# Altium schematic sheet Napajanje.SchDoc
size A4
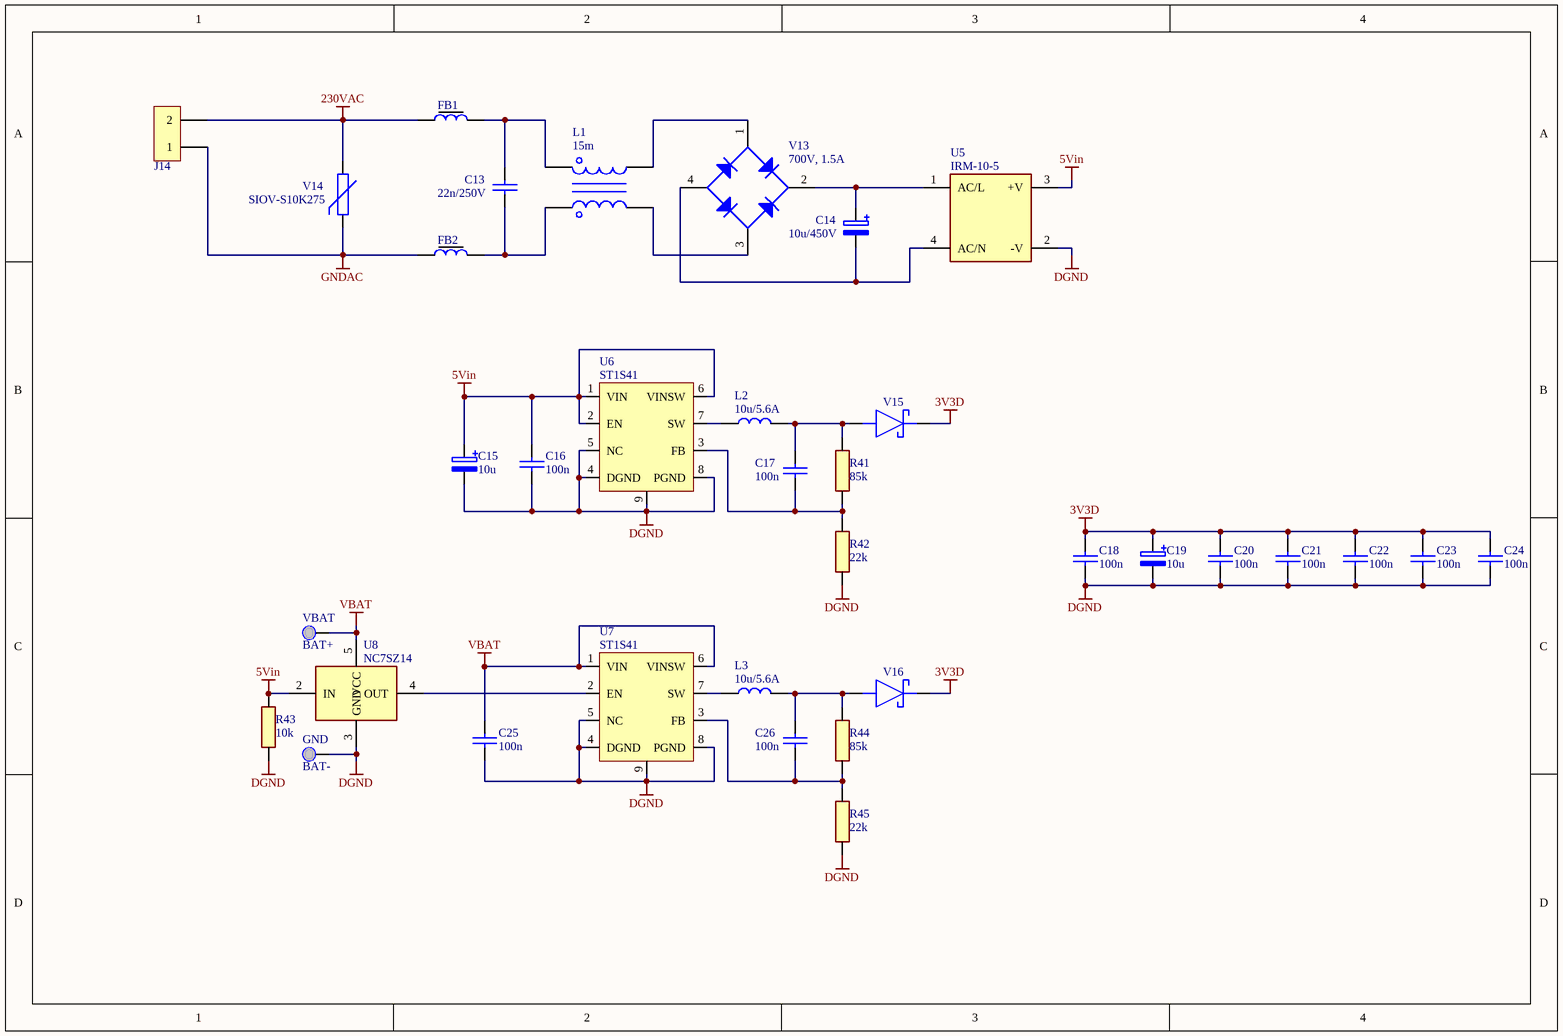
[diagram p0: Napajanje.SchDoc]

## Parts
BAT+  VBAT  [PAD_th]
BAT-  GND  [PAD_th]
C13  22n/250V  [CAP_CK03_TH]
C14  10u/450V  [CAP_EL_ALU]
C15  10u  [CAP_EL_CASE_B_SMD]
C16  100n  [CAP_0805_SMD]
C17  100n  [CAP_0805_SMD]
C18  100n  [CAP_0805_SMD]
C19  10u  [CAP_EL_CASE_B_SMD]
C20  100n  [CAP_0805_SMD]
C21  100n  [CAP_0805_SMD]
C22  100n  [CAP_0805_SMD]
C23  100n  [CAP_0805_SMD]
C24  100n  [CAP_0805_SMD]
C25  100n  [CAP_0805_SMD]
C26  100n  [CAP_0805_SMD]
FB1  (no value)  [FERITE_BEAD]
FB2  (no value)  [FERITE_BEAD]
J14  CON2  [CON-MSTB-5.08-2p]  (value not drawn)
L1  15m  [CHOKE_10_12.5]
L2  10u/5.6A  [PIS4720]
L3  10u/5.6A  [PIS4720]
R41  85k  [RES_0805_SMD]
R42  22k  [RES_0805_SMD]
R43  10k  [RES_0805_SMD]
R44  85k  [RES_0805_SMD]
R45  22k  [RES_0805_SMD]
U5  IRM-10-5  [IRM-10-5]
U6  ST1S41  [ST1S41]
U7  ST1S41  [ST1S41]
U8  NC7SZ14  [NC7SZ14]
V13  700V, 1.5A  [GRETZ]
V14  SIOV-S10K275  [VARISTOR]
V15  DIODE SCHOTTKY  [DIODE-SCHOTTKY]  (value not drawn)
V16  DIODE SCHOTTKY  [DIODE-SCHOTTKY]  (value not drawn)

## Nets
3V3D: C18.2 C19.1 C20.2 C21.2 C22.2 C23.2 C24.2 V15.1(K) V16.1(K)
5Vin: C15.1 C16.2 R43.2 U5.3(+V) U6.1(VIN) U6.2(EN) U6.6(VINSW) U8.2(IN)
230VAC: FB1.1 J14.2 V14.2
DGND: BAT-.1 C15.2 C16.1 C18.1 C19.2 C20.1 C21.1 C22.1 C23.1 C24.1 C25.1 R42.1 R43.1 R45.1 U5.2(-V) U6.4(DGND) U6.5(NC) U6.8(PGND) U6.9(DGND) U7.4(DGND) U7.5(NC) U7.8(PGND) U7.9(DGND) U8.3(GND)
GNDAC: FB2.1 J14.1 V14.1
VBAT: BAT+.1 C25.2 U7.1(VIN) U7.6(VINSW) U8.5(VCC)
NetC13_1: C13.1 FB2.2 L1.1
NetC13_2: C13.2 FB1.2 L1.2
NetC14_1: C14.1 U5.1(AC/L) V13.2
NetC14_2: C14.2 U5.4(AC/N) V13.4
NetC17_1: C17.1 R41.1 R42.2 U6.3(FB)
NetC17_2: C17.2 L2.2 R41.2 V15.2(A)
NetC26_1: C26.1 R44.1 R45.2 U7.3(FB)
NetC26_2: C26.2 L3.2 R44.2 V16.2(A)
NetL1_3: L1.3 V13.3
NetL1_4: L1.4 V13.1
NetL2_1: L2.1 U6.7(SW)
NetL3_1: L3.1 U7.7(SW)
NetU7_2: U7.2(EN) U8.4(OUT)

## Library data of the parts
BAT+ BAT- = PAD: Single pad
C13 = CAP_CK03: MKX2AW24702F00KSSD; Manufacturer_Name: WIMA; Datasheet Link: https://componentsearchengine.com//MKX2AW24702F00KSSD.pdf; Height: 12.5mm; Mouser2 Part Number: 505-MKX2AW24702F00KS; Mouser2 Price/Stock: https://www.mouser.com/Search/Refine.aspx?Keyword=505-MKX2AW24702F00KS; Manufacturer_Part_Number: MKX2AW24702F00KSSD
C14 C15 C19 = CAP_EL: ELECTROLYTIC TH, CASE B
C16-C18 C20-C26 = CAP: 0805
FB1 FB2 = FERITE_BEAD: 875-HI1206N101R
J14 = CON2: 2 pole connector
L1 = CHOKE: 871-B82731M290
L2 L3 = INDUCTOR
R41-R45 = RES: 0805
U5 = IRM-10-5: AC-DC converter
U6 U7 = ST1S41: DC-DC Buck convertor
U8 = NC7SZ14: Invertor
V13 = GRETZ: W10G
V14 = VARISTOR
V15 V16 = DIODE SCHOTTKY: Schottky diode